# EAGLE design UsbAtMega (EAGLE 6.5.0)
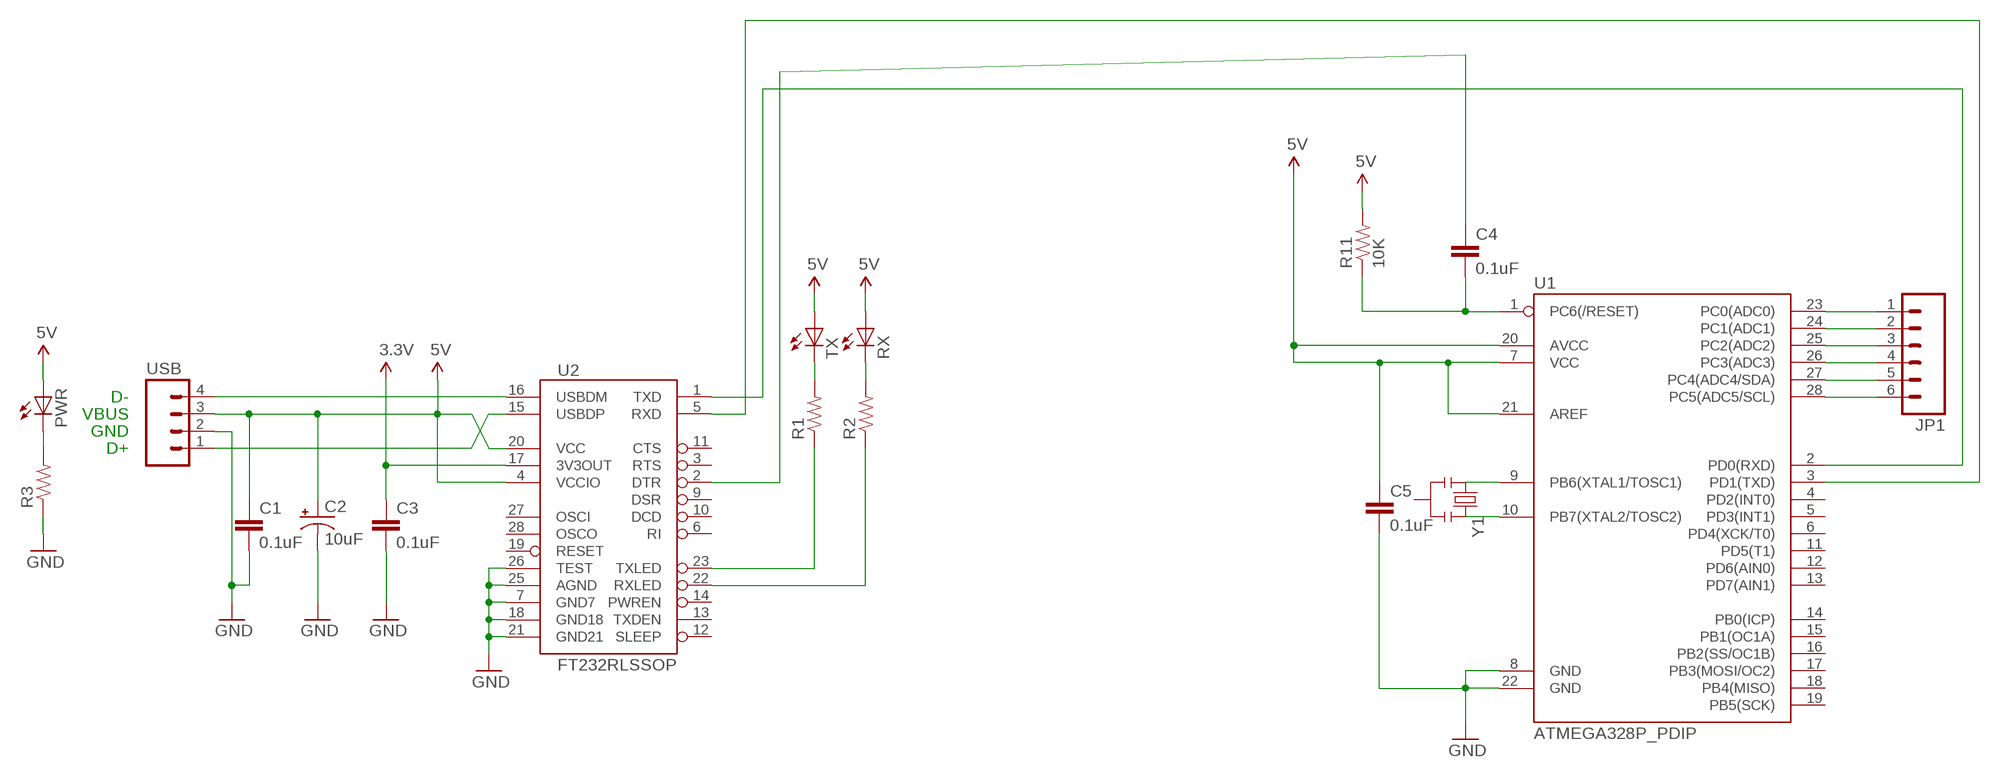
[diagram p0: schematic, sheet 1]

## Parts
C1  0.1uF  CAPEZ  [CAP-PTH-SMALLEZ]
C2  10uF  CAP_POLPTH2  [CPOL-RADIAL-10UF-25V]
C3  0.1uF  CAPEZ  [CAP-PTH-SMALLEZ]
C4  0.1uF  CAPPTH  [CAP-PTH-SMALL]
C5  0.1uF  CAPPTH  [CAP-PTH-SMALL]
JP1  M06SIP  [1X06]
PWR  LED5MM  [LED5MM]
R1  10KOHM1/6W5%(PTH)KIT  [AXIAL-0.3-KIT]
R2  10KOHM1/6W5%(PTH)KIT  [AXIAL-0.3-KIT]
R3  10KOHM1/6W5%(PTH)KIT  [AXIAL-0.3-KIT]
R11  10K  RESISTORAXIAL-0.3  [AXIAL-0.3]
RX  LED5MM  [LED5MM]
TX  LED5MM  [LED5MM]
U1  ATMEGA328P_PDIP  [DIL28-3]
U2  FT232RLSSOP  [SSOP28DB]
USB  M04LOCK  [1X04_LOCK]
Y1  RESONATORPTH  [RESONATOR-PTH]

## Nets
3.3V: C3.1 U2.17(3V3OUT)
5V: C1.1 C2.1(+) C5.1 PWR.A R11.P$2 RX.A TX.A U1.7(VCC) U1.20(AVCC) U1.21(AREF) U2.4(VCCIO) U2.20(VCC) USB.3
GND: C1.2 C2.2(-) C3.2 C5.2 R3.P$1 U1.8(GND) U1.22(GND) U2.7(GND7) U2.18(GND18) U2.21(GND21) U2.25(AGND) U2.26(TEST) USB.2
N$1: C4.2 R11.P$1 U1.1(PC6(/RESET))
N$2: U2.16(USBDM) USB.4
N$3: U2.15(USBDP) USB.1
N$4: C4.1 U2.2(DTR)
N$5: U1.2(PD0(RXD)) U2.1(TXD)
N$6: U1.3(PD1(TXD)) U2.5(RXD)
N$7: U1.9(PB6(XTAL1/TOSC1)) Y1.1
N$8: U1.10(PB7(XTAL2/TOSC2)) Y1.3
N$9: JP1.6 U1.28(PC5(ADC5/SCL))
N$10: JP1.5 U1.27(PC4(ADC4/SDA))
N$11: JP1.4 U1.26(PC3(ADC3))
N$12: JP1.3 U1.25(PC2(ADC2))
N$13: R1.P$1 U2.23(TXLED)
N$14: R2.P$1 U2.22(RXLED)
N$15: R1.P$2 TX.K(C)
N$16: R2.P$2 RX.K(C)
N$17: PWR.K(C) R3.P$2
N$18: JP1.2 U1.24(PC1(ADC1))
N$19: JP1.1 U1.23(PC0(ADC0))
Unconnected: U1.4(PD2(INT0)) U1.5(PD3(INT1)) U1.6(PD4(XCK/T0)) U1.11(PD5(T1)) U1.12(PD6(AIN0)) U1.13(PD7(AIN1)) U1.14(PB0(ICP)) U1.15(PB1(OC1A)) U1.16(PB2(SS/OC1B)) U1.17(PB3(MOSI/OC2)) U1.18(PB4(MISO)) U1.19(PB5(SCK)) U2.3(RTS) U2.6(RI) U2.9(DSR) U2.10(DCD) U2.11(CTS) U2.12(SLEEP) U2.13(TXDEN) U2.14(PWREN) U2.19(RESET) U2.27(OSCI) U2.28(OSCO) Y1.2

## Notes on the sheet
- D-
- VBUS
- GND
- D+

## Library data of the parts
C1 C3 = SparkFun-Capacitors:CAP: Capacitor Standard 0603 ceramic capacitor, and 0.1" leaded capacitor.
C2 = SparkFun-Capacitors:CAP_POL: Capacitor Polarized These are standard SMD and PTH capacitors. Normally 10uF, 47uF, and 100uF in electrolytic and tantalum varieties. Always verify the external diameter of the through hole cap, it varies with capacity, voltage, and manufacturer. The EIA devices should be standard.
C4 C5 = SparkFun-Passives:CAP: Capacitor Standard 0603 ceramic capacitor, and 0.1" leaded capacitor.
JP1 = SparkFun-Connectors:M06: Header 6 Standard 6-pin 0.1" header. Use with straight break away headers (SKU : PRT-00116), right angle break away headers (PRT-00553), swiss pins (PRT-00743), machine pins (PRT-00117), and female headers (PRT-00115). Molex polarized connector foot print use with SKU : PRT-08094 with associated crimp pins and housings. NOTES ON THE VARIANTS LOCK and LOCK_LONGPADS... This footprint was designed to help hold the alignment of a through-hole component (i.e. 6-pin header) while soldering it into place. You may notice that each hole has been shifted either up or down by 0.005 of an inch from it's more standard position (which is a perfectly straight line). This slight alteration caused the pins (the squares in the middle) to touch the edges of the holes. Because they are alternating, it causes a "brace" to hold the component in place. 0.005 has proven to be the perfect amount of "off-center" position when using our standard breakaway headers. Although looks a little odd when you look at the bare footprint, once you have a header in there, the alteration is very hard to notice. Also,if you push a header all the way into place, it is covered up entirely on the bottom side. This idea of altering the position of holes to aid alignment will be further integrated into the Sparkfun Library for other footprints. It can help hold any component with 3 or more connection pins.
PWR RX TX = SparkFun-LED:LED: LEDs Standard schematic elements and footprints for 5mm, 3mm, 1206, and 0603 sized LEDs. 5mm - Spark Fun Electronics SKU : COM-00529 (and others)
R1-R3 = SparkFun-Resistors:10KOHM1/6W5%(PTH): RES-08375; PROD_ID: RES-08375
R11 = SparkFun-Resistors:RESISTOR: Resistor Basic schematic elements and footprints for 0603, 1206, and PTH resistors.
U1 = SparkFun-DigitalIC:ATMEGA328P_PDIP: uC used in the Arduino 32kb flash, 1k EEPROM, 2k SRAM This is the through-hole version of this chip.
U2 = SparkFun-DigitalIC:FT232RL: USB UART FT232RL 4th Generation USB UART (USB <-> Serial) Controller. Spark Fun Electronics SKU : COM-00650 Production SKU IC-00870; PROD_ID: IC-00870
USB = SparkFun-Connectors:M04: Header 4 Standard 4-pin 0.1" header. Use with straight break away headers (SKU : PRT-00116), right angle break away headers (PRT-00553), swiss pins (PRT-00743), machine pins (PRT-00117), and female headers (PRT-00115). Molex polarized connector foot print use with SKU : PRT-08231 with associated crimp pins and housings. 1MM SMD Version SKU: PRT-10208
Y1 = SparkFun-FreqCtrl:RESONATOR: Resonator Small SMD resonator. Used, eg, on the Arduino Pro/ Pro Mini boards. 8MHz- XTAL-08895 16MHz- XTAL-08900

## Board
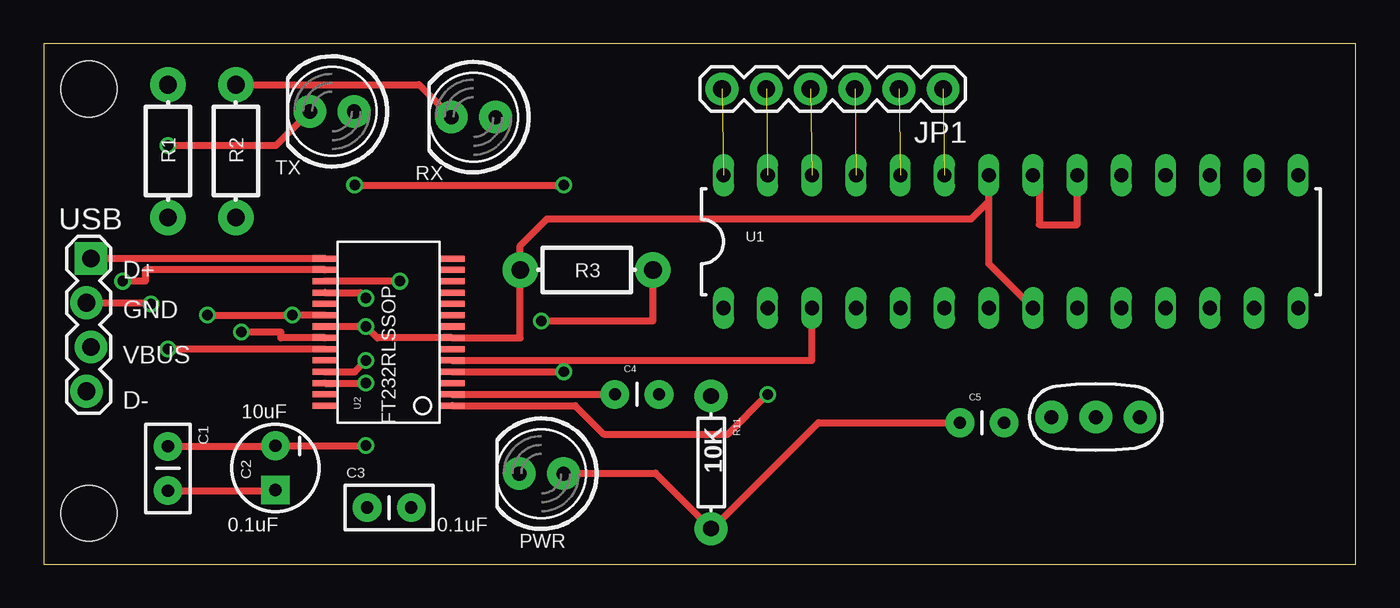
[diagram p1: board, top side]
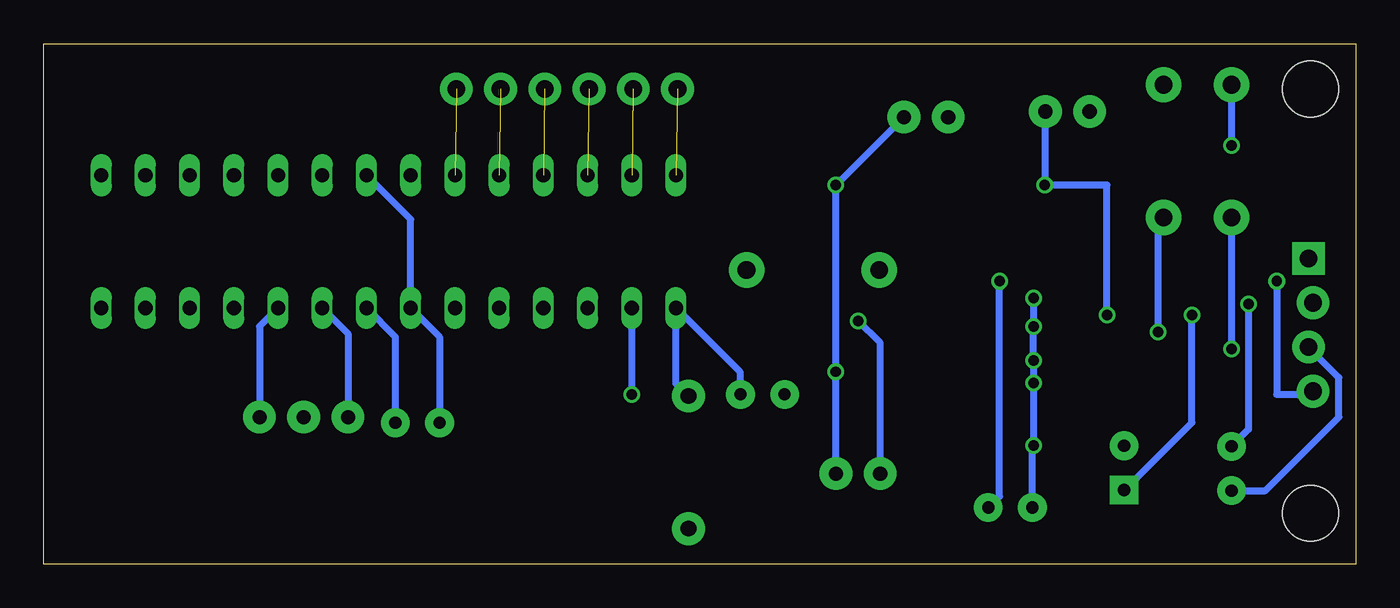
[diagram p2: board, bottom side, seen from below]

Size 75.4 x 29.9 mm. Coordinates in mm from the lower left corner, seen from the top.
Outline: 0,0 75.4,0 75.4,29.9 0,29.9 0,0
Copper layers (1*16): Top 0.0356mm / dielectric 1.5011mm / Bottom 0.0356mm
Design rules "LaenPCBOrder": minimum track width 6mil, minimum drill 13mil, track to track 6mil, track to pad 6mil, pad to pad 6mil, via to via 6mil, smd to smd 6mil, copper to edge 15mil, drill to drill 6mil, minimum pad ring 7mil, minimum via ring 7mil, stop-mask expansion 3mil, vias tented up to drill 0mil, thermal gap 10mil
Holes 3.2 mm at 2.6,27.3 2.6,2.92

### Footprints (pad centres in the part's own frame; a part is rotated, then mirrored left to right if it is on the bottom)
CAP-PTH-SMALLEZ = drill 0.7 pad 1.651: 1 0,0; 2 2.54,0
CPOL-RADIAL-10UF-25V = drill 0.7 pad 1.651 square: 1 1.27,0 | drill 0.7 pad 1.651: 2 -1.27,0
CAP-PTH-SMALL = drill 0.7 pad 1.651: 1 0,0; 2 2.54,0
1X06 = drill 1.016 pad 1.88: 1 0,0; 2 2.54,0; 3 5.08,0; 4 7.62,0; 5 10.16,0; 6 12.7,0
LED5MM = drill 0.813 pad 1.88: A -1.27,0; K 1.27,0
AXIAL-0.3-KIT = drill 1.016 pad 2.032: P$1 -3.81,0; P$2 3.81,0
AXIAL-0.3 = drill 0.9 pad 1.88: P$1 -3.81,0; P$2 3.81,0
DIL28-3 = drill 0.813 long: 1 -16.51,-3.81; 2 -13.97,-3.81; 3 -11.43,-3.81; 4 -8.89,-3.81; 5 -6.35,-3.81; 6 -3.81,-3.81; 7 -1.27,-3.81; 8 1.27,-3.81; 9 3.81,-3.81; 10 6.35,-3.81; 11 8.89,-3.81; 12 11.43,-3.81; 13 13.97,-3.81; 14 16.51,-3.81; 15 16.51,3.81; 16 13.97,3.81; 17 11.43,3.81; 18 8.89,3.81; 19 6.35,3.81; 20 3.81,3.81; 21 1.27,3.81; 22 -1.27,3.81; 23 -3.81,3.81; 24 -6.35,3.81; 25 -8.89,3.81; 26 -11.43,3.81; 27 -13.97,3.81; 28 -16.51,3.81
SSOP28DB = smd 0.348 x 1.397: 1 -4.225,-3.656; 2 -3.575,-3.656; 3 -2.925,-3.656; 4 -2.275,-3.656; 5 -1.625,-3.656; 6 -0.975,-3.656; 7 -0.325,-3.656; 8 0.325,-3.656; 9 0.975,-3.656; 10 1.625,-3.656; 11 2.275,-3.656; 12 2.925,-3.656; 13 3.575,-3.656; 14 4.225,-3.656; 15 4.225,3.656; 16 3.575,3.656; 17 2.925,3.656; 18 2.275,3.656; 19 1.625,3.656; 20 0.975,3.656; 21 0.325,3.656; 22 -0.325,3.656; 23 -0.975,3.656; 24 -1.625,3.656; 25 -2.275,3.656; 26 -2.925,3.656; 27 -3.575,3.656; 28 -4.225,3.656
1X04_LOCK = drill 1.016 pad 1.88 square: 1 0,0.127 | drill 1.016 pad 1.88: 2 2.54,-0.127; 3 5.08,0.127; 4 7.62,-0.127
RESONATOR-PTH = drill 0.8 pad 1.88: 1 -2.54,0; 2 0,0; 3 2.54,0

### Placement (x,y rotation side)
C1  7.15,4.22 90 top
C2  13.32,5.53 270 top
C3  21.12,3.25 180 top
C4  32.83,9.75 0 top
C5  52.65,8.12 0 top
JP1  51.68,27.29 180 top
PWR  28.6,5.2 180 top
R1  7.15,23.73 90 top
R2  11.05,23.73 90 top
R3  31.2,16.9 0 top
R11  38.35,5.85 270 top
RX  24.7,25.68 180 top
TX  16.57,26 180 top
U1  55.58,18.52 0 top
U2  19.82,13.32 90 top
USB  2.6,17.55 270 top
Y1  60.45,8.45 0 top

### Tracks (layer width: path | path; a pad name or v marks a point on that pad's centre or on a via)
3.3V  (via drill 0.6)
  Top 0.406: v20.48,16.25 U2.17
  Bottom 0.406: C3.1 20.48,3.9 v20.48,16.25
5V  (via drill 0.6)
  Top 0.406: C1.1 13.29,4.22 C2.1 | U2.4 v29.9,11.05 | v17.88,21.77 v29.9,21.77 | U2.20 v14.3,14.3 v9.43,14.3 | v29.9,5.23 35.16,5.23 R11.P$2 38.44,2.04 44.52,8.12 C5.1 | U1.21 57.2,22.34 57.2,19.5 59.38,19.5 U1.20
  Bottom 0.406: C1.1 5.2,4.22 0.97,8.45 0.97,10.72 USB.3 | C2.1 13.29,4.25 9.43,8.12 v9.43,14.3 | PWR.A v29.9,5.23 v29.9,11.05 v29.9,21.77 29.87,21.77 RX.A | TX.A 17.88,25.97 v17.88,21.77 14.3,21.77 v14.3,14.3 | U1.21 54.3,19.8 U1.7 52.65,13.06 C5.1
GND  (via drill 0.6)
  Top 0.406: USB.2 6.12,15.01 v6.17,14.95 | C1.2 13.29,6.76 C2.2 18.5,6.79 v18.52,6.83 | U2.26 v18.52,10.4 | U2.25 17.88,11.05 v18.52,11.7 | U2.21 v18.52,13.65 19.18,13 U2.7 27.39,13 R3.P$1 27.39,18.29 28.93,19.82 53.3,19.82 54.3,20.83 | U2.18 18.2,15.6 v18.52,15.28 | 54.3,20.83 54.3,21.77 U1.22 | U1.8 54.3,17.25 54.3,20.83
  Bottom 0.406: v6.17,14.95 6.17,7.74 C1.2 | C3.2 18.59,6.76 v18.52,6.83 v18.52,10.4 v18.52,11.7 v18.52,13.65 v18.52,15.28 | U1.8 55.19,13.06 C5.2
N$1
  Bottom 0.406: R11.P$1 39.06,10.38 U1.1 35.37,11.02 C4.2
N$2  (via drill 0.6)
  Top 0.406: U2.16 5.85,16.9 5.85,16.25 v4.55,16.25
  Bottom 0.406: v4.55,16.25 4.55,9.75 2.47,9.75 USB.4
N$3
  Top 0.406: U2.15 USB.1
N$4
  Top 0.406: U2.2 C4.1
N$5  (via drill 0.6)
  Top 0.406: U2.1 30.55,9.1 32.17,7.47 39.33,7.47 v41.6,9.75
  Bottom 0.406: v41.6,9.75 U1.2
N$6
  Top 0.406: U2.5 44.15,11.7 U1.3
N$7
  Bottom 0.406: U1.9 57.91,13.24 Y1.1
N$8
  Bottom 0.406: U1.10 62.99,13.65 Y1.3
N$9  (1 unrouted)
N$10  (1 unrouted)
N$11  (1 unrouted)
N$12  (1 unrouted)
N$13  (via drill 0.6)
  Top 0.406: U2.23 v7.15,12.35
  Bottom 0.406: R1.P$1 v7.15,12.35
N$14  (via drill 0.6)
  Top 0.406: U2.22 13.65,13 13.65,13.32 v11.38,13.32
  Bottom 0.406: R2.P$1 11.38,19.91 v11.38,13.32
N$15  (via drill 0.6)
  Top 0.406: v7.15,24.05 13.36,24.05 TX.K
  Bottom 0.406: R1.P$2 v7.15,24.05
N$16
  Top 0.406: R2.P$2 21.57,27.54 RX.K
N$17  (via drill 0.6)
  Top 0.406: v28.6,13.97 35.01,13.97 R3.P$2
  Bottom 0.406: PWR.K 27.33,12.71 v28.6,13.97
N$18  (1 unrouted)
N$19  (1 unrouted)

### Text on the board
tNames: D+ | GND | VBUS | FT232RLSSOP | D- | 10uF | 0.1uF | 0.1uF